# Altium schematic sheet DC075B_ANALOG_INPUTS.SchDoc: ANALOG INPUTS
size 558 x 431 mm; DrawnBy: Praveen Aroul; DocumentNumber: 5; SheetNumber: 5; SheetTotal: 13; PageSetup: Record=PageOptions|CenterHorizontal=True|CenterVertical=True|PrintScale=1.00|XCorrection=1.00|YCorrection=1.00|PrintKind=0|BorderSize=5000000|LeftOffset=0|BottomOffset=0|Orientation=2|PaperLength=1000|PaperWidth=1000|Scale=100|PaperSource=15|PrintQuality=600|MediaType=1|DitherType=10|PaperKind=Letter|PrintScaleMode=1
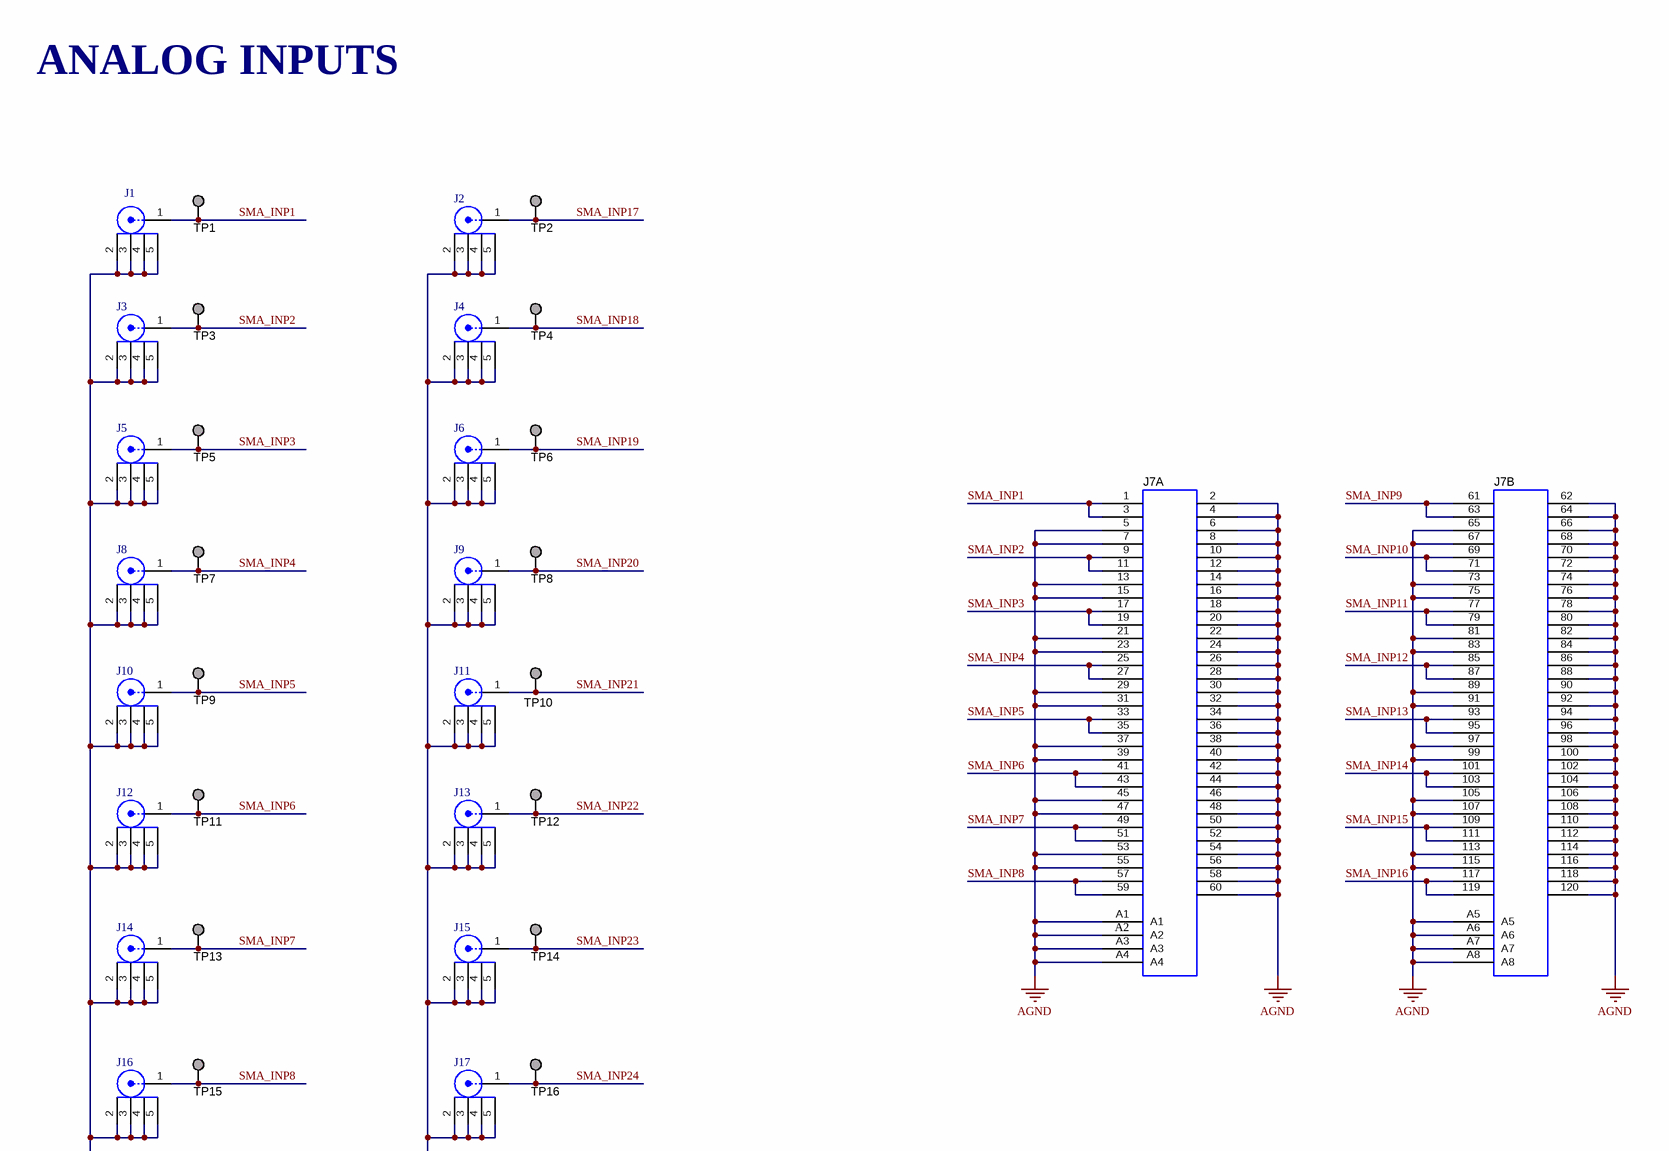
[diagram p0: DC075B_ANALOG_INPUTS.SchDoc, top left]
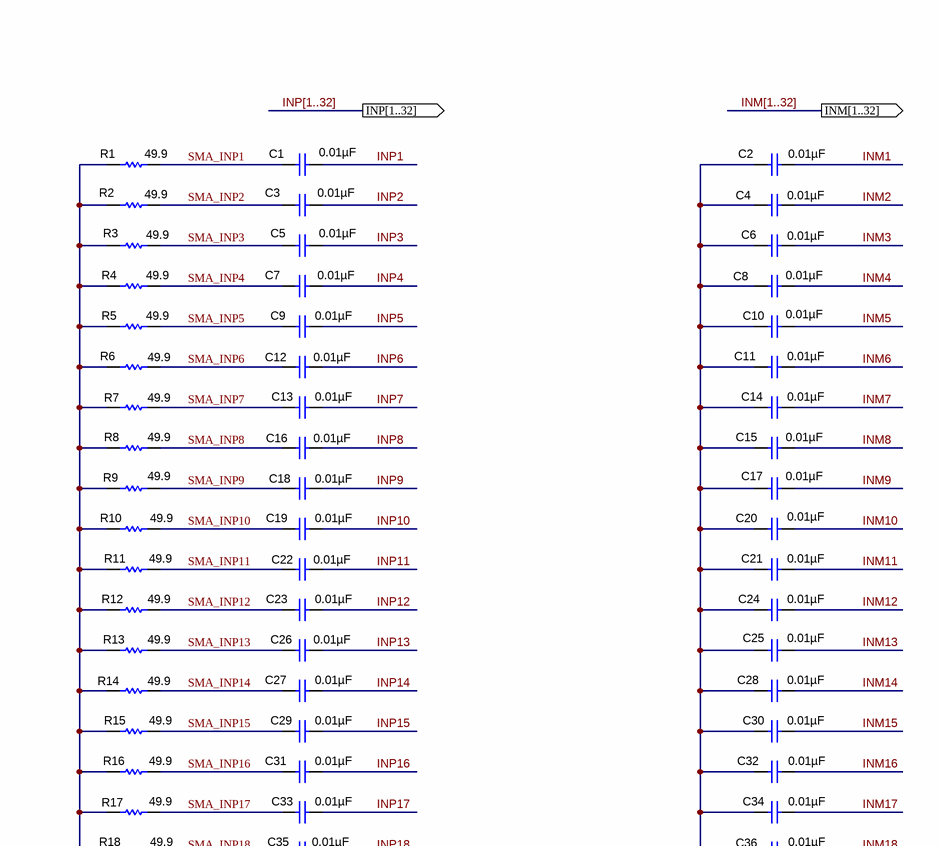
[diagram p1: DC075B_ANALOG_INPUTS.SchDoc, top right]
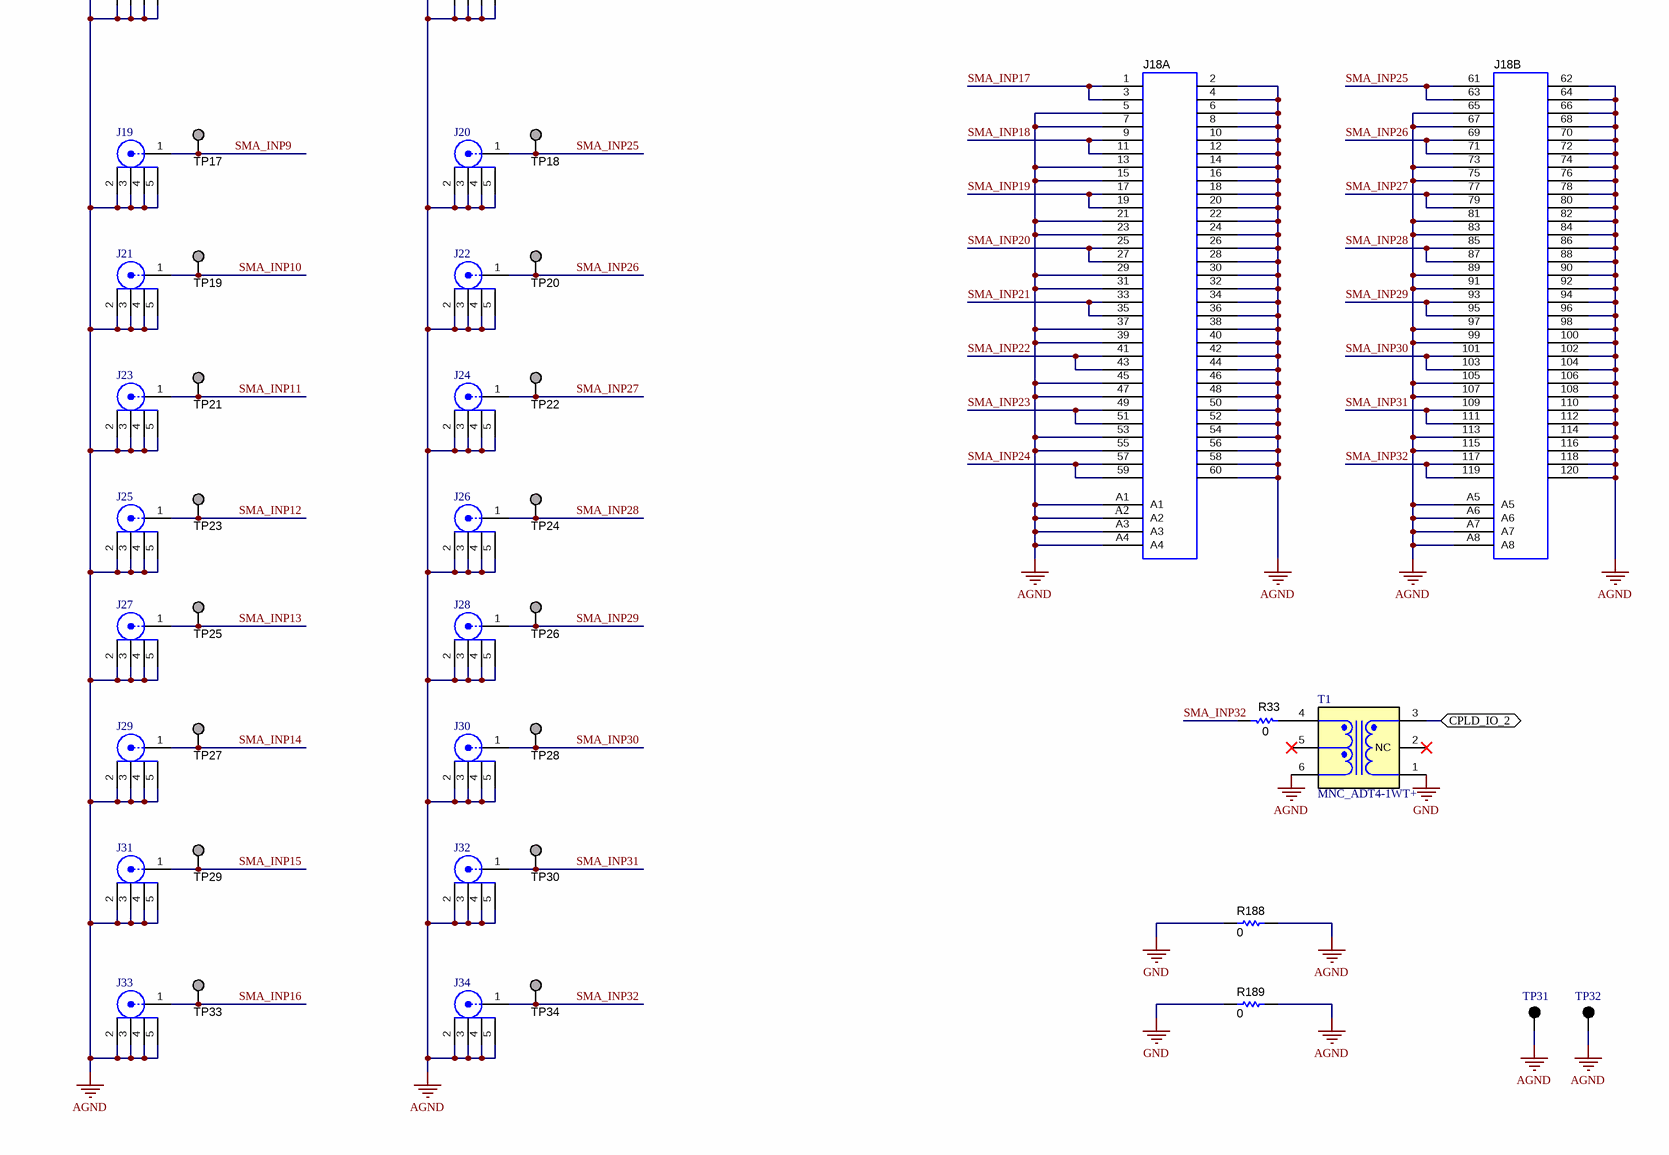
[diagram p2: DC075B_ANALOG_INPUTS.SchDoc, bottom left]
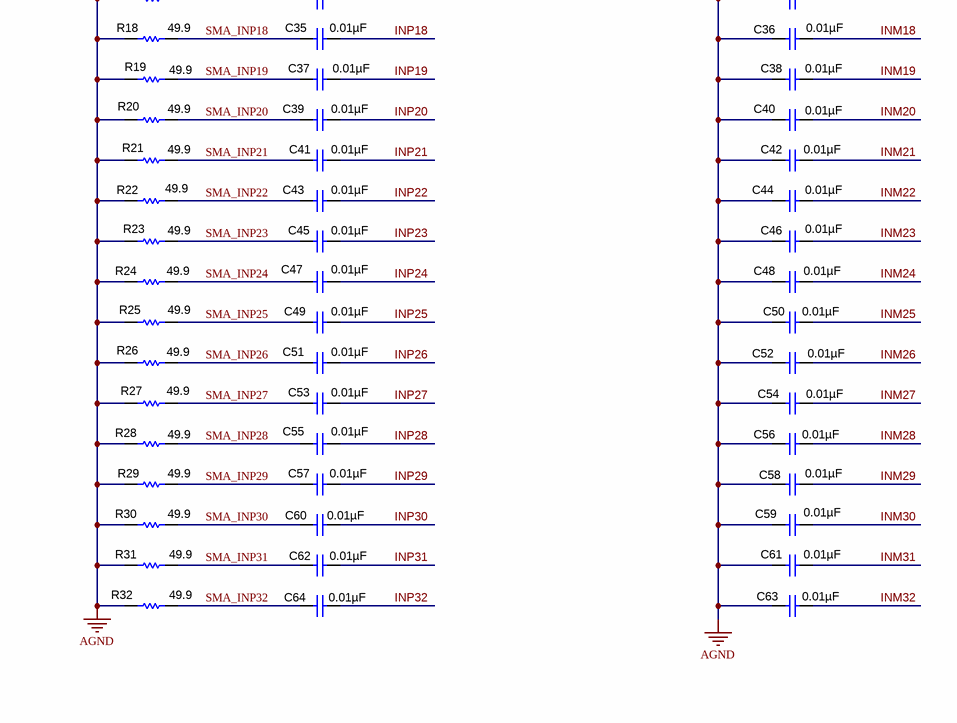
[diagram p3: DC075B_ANALOG_INPUTS.SchDoc, bottom right]

## Parts
C1  ValueDisplayed: 0.01µF  [0402]  (hidden comment: 04023C103JAT2A)
C2  ValueDisplayed: 0.01µF  [0402]  (hidden comment: 04023C103JAT2A)
C3  ValueDisplayed: 0.01µF  [0402]  (hidden comment: 04023C103JAT2A)
C4  ValueDisplayed: 0.01µF  [0402]  (hidden comment: 04023C103JAT2A)
C5  ValueDisplayed: 0.01µF  [0402]  (hidden comment: 04023C103JAT2A)
C6  ValueDisplayed: 0.01µF  [0402]  (hidden comment: 04023C103JAT2A)
C7  ValueDisplayed: 0.01µF  [0402]  (hidden comment: 04023C103JAT2A)
C8  ValueDisplayed: 0.01µF  [0402]  (hidden comment: 04023C103JAT2A)
C9  ValueDisplayed: 0.01µF  [0402]  (hidden comment: 04023C103JAT2A)
C10  ValueDisplayed: 0.01µF  [0402]  (hidden comment: 04023C103JAT2A)
C11  ValueDisplayed: 0.01µF  [0402]  (hidden comment: 04023C103JAT2A)
C12  ValueDisplayed: 0.01µF  [0402]  (hidden comment: 04023C103JAT2A)
C13  ValueDisplayed: 0.01µF  [0402]  (hidden comment: 04023C103JAT2A)
C14  ValueDisplayed: 0.01µF  [0402]  (hidden comment: 04023C103JAT2A)
C15  ValueDisplayed: 0.01µF  [0402]  (hidden comment: 04023C103JAT2A)
C16  ValueDisplayed: 0.01µF  [0402]  (hidden comment: 04023C103JAT2A)
C17  ValueDisplayed: 0.01µF  [0402]  (hidden comment: 04023C103JAT2A)
C18  ValueDisplayed: 0.01µF  [0402]  (hidden comment: 04023C103JAT2A)
C19  ValueDisplayed: 0.01µF  [0402]  (hidden comment: 04023C103JAT2A)
C20  ValueDisplayed: 0.01µF  [0402]  (hidden comment: 04023C103JAT2A)
C21  ValueDisplayed: 0.01µF  [0402]  (hidden comment: 04023C103JAT2A)
C22  ValueDisplayed: 0.01µF  [0402]  (hidden comment: 04023C103JAT2A)
C23  ValueDisplayed: 0.01µF  [0402]  (hidden comment: 04023C103JAT2A)
C24  ValueDisplayed: 0.01µF  [0402]  (hidden comment: 04023C103JAT2A)
C25  ValueDisplayed: 0.01µF  [0402]  (hidden comment: 04023C103JAT2A)
C26  ValueDisplayed: 0.01µF  [0402]  (hidden comment: 04023C103JAT2A)
C27  ValueDisplayed: 0.01µF  [0402]  (hidden comment: 04023C103JAT2A)
C28  ValueDisplayed: 0.01µF  [0402]  (hidden comment: 04023C103JAT2A)
C29  ValueDisplayed: 0.01µF  [0402]  (hidden comment: 04023C103JAT2A)
C30  ValueDisplayed: 0.01µF  [0402]  (hidden comment: 04023C103JAT2A)
C31  ValueDisplayed: 0.01µF  [0402]  (hidden comment: 04023C103JAT2A)
C32  ValueDisplayed: 0.01µF  [0402]  (hidden comment: 04023C103JAT2A)
C33  ValueDisplayed: 0.01µF  [0402]  (hidden comment: 04023C103JAT2A)
C34  ValueDisplayed: 0.01µF  [0402]  (hidden comment: 04023C103JAT2A)
C35  ValueDisplayed: 0.01µF  [0402]  (hidden comment: 04023C103JAT2A)
C36  ValueDisplayed: 0.01µF  [0402]  (hidden comment: 04023C103JAT2A)
C37  ValueDisplayed: 0.01µF  [0402]  (hidden comment: 04023C103JAT2A)
C38  ValueDisplayed: 0.01µF  [0402]  (hidden comment: 04023C103JAT2A)
C39  ValueDisplayed: 0.01µF  [0402]  (hidden comment: 04023C103JAT2A)
C40  ValueDisplayed: 0.01µF  [0402]  (hidden comment: 04023C103JAT2A)
C41  ValueDisplayed: 0.01µF  [0402]  (hidden comment: 04023C103JAT2A)
C42  ValueDisplayed: 0.01µF  [0402]  (hidden comment: 04023C103JAT2A)
C43  ValueDisplayed: 0.01µF  [0402]  (hidden comment: 04023C103JAT2A)
C44  ValueDisplayed: 0.01µF  [0402]  (hidden comment: 04023C103JAT2A)
C45  ValueDisplayed: 0.01µF  [0402]  (hidden comment: 04023C103JAT2A)
C46  ValueDisplayed: 0.01µF  [0402]  (hidden comment: 04023C103JAT2A)
C47  ValueDisplayed: 0.01µF  [0402]  (hidden comment: 04023C103JAT2A)
C48  ValueDisplayed: 0.01µF  [0402]  (hidden comment: 04023C103JAT2A)
C49  ValueDisplayed: 0.01µF  [0402]  (hidden comment: 04023C103JAT2A)
C50  ValueDisplayed: 0.01µF  [0402]  (hidden comment: 04023C103JAT2A)
C51  ValueDisplayed: 0.01µF  [0402]  (hidden comment: 04023C103JAT2A)
C52  ValueDisplayed: 0.01µF  [0402]  (hidden comment: 04023C103JAT2A)
C53  ValueDisplayed: 0.01µF  [0402]  (hidden comment: 04023C103JAT2A)
C54  ValueDisplayed: 0.01µF  [0402]  (hidden comment: 04023C103JAT2A)
C55  ValueDisplayed: 0.01µF  [0402]  (hidden comment: 04023C103JAT2A)
C56  ValueDisplayed: 0.01µF  [0402]  (hidden comment: 04023C103JAT2A)
C57  ValueDisplayed: 0.01µF  [0402]  (hidden comment: 04023C103JAT2A)
C58  ValueDisplayed: 0.01µF  [0402]  (hidden comment: 04023C103JAT2A)
C59  ValueDisplayed: 0.01µF  [0402]  (hidden comment: 04023C103JAT2A)
C60  ValueDisplayed: 0.01µF  [0402]  (hidden comment: 04023C103JAT2A)
C61  ValueDisplayed: 0.01µF  [0402]  (hidden comment: 04023C103JAT2A)
C62  ValueDisplayed: 0.01µF  [0402]  (hidden comment: 04023C103JAT2A)
C63  ValueDisplayed: 0.01µF  [0402]  (hidden comment: 04023C103JAT2A)
C64  ValueDisplayed: 0.01µF  [0402]  (hidden comment: 04023C103JAT2A)
J1  SMA_Contact1_GND2345  [Johnson_142-0701-801]  (value not drawn)
J2  5-1814832-1  [TE_5-1814832-1]  (value not drawn)
J3  5-1814832-1  [TE_5-1814832-1]  (value not drawn)
J4  SMA_Contact1_GND2345  [Johnson_142-0701-801]  (value not drawn)
J5  5-1814832-1  [TE_5-1814832-1]  (value not drawn)
J6  5-1814832-1  [TE_5-1814832-1]  (value not drawn)
J7  SAMTEC_QTH-060-01-L-D-A  [SAMTEC_QTH-060-01-L-D-A]  (value not drawn)  (parts A,B of 2)
J8  SMA_Contact1_GND2345  [Johnson_142-0701-801]  (value not drawn)
J9  5-1814832-1  [TE_5-1814832-1]  (value not drawn)
J10  5-1814832-1  [TE_5-1814832-1]  (value not drawn)
J11  SMA_Contact1_GND2345  [Johnson_142-0701-801]  (value not drawn)
J12  5-1814832-1  [TE_5-1814832-1]  (value not drawn)
J13  5-1814832-1  [TE_5-1814832-1]  (value not drawn)
J14  SMA_Contact1_GND2345  [Johnson_142-0701-801]  (value not drawn)
J15  5-1814832-1  [TE_5-1814832-1]  (value not drawn)
J16  5-1814832-1  [TE_5-1814832-1]  (value not drawn)
J17  SMA_Contact1_GND2345  [Johnson_142-0701-801]  (value not drawn)
J18  SAMTEC_QTH-060-01-L-D-A  [SAMTEC_QTH-060-01-L-D-A]  (value not drawn)  (parts A,B of 2)
J19  5-1814832-1  [TE_5-1814832-1]  (value not drawn)
J20  5-1814832-1  [TE_5-1814832-1]  (value not drawn)
J21  SMA_Contact1_GND2345  [Johnson_142-0701-801]  (value not drawn)
J22  5-1814832-1  [TE_5-1814832-1]  (value not drawn)
J23  5-1814832-1  [TE_5-1814832-1]  (value not drawn)
J24  SMA_Contact1_GND2345  [Johnson_142-0701-801]  (value not drawn)
J25  5-1814832-1  [TE_5-1814832-1]  (value not drawn)
J26  5-1814832-1  [TE_5-1814832-1]  (value not drawn)
J27  SMA_Contact1_GND2345  [Johnson_142-0701-801]  (value not drawn)
J28  5-1814832-1  [TE_5-1814832-1]  (value not drawn)
J29  5-1814832-1  [TE_5-1814832-1]  (value not drawn)
J30  SMA_Contact1_GND2345  [Johnson_142-0701-801]  (value not drawn)
J31  5-1814832-1  [TE_5-1814832-1]  (value not drawn)
J32  5-1814832-1  [TE_5-1814832-1]  (value not drawn)
J33  5-1814832-1  [TE_5-1814832-1]  (value not drawn)
J34  5-1814832-1  [TE_5-1814832-1]  (value not drawn)
R1  value 49.9  [0402]  (hidden comment: Resistor)
R2  value 49.9  [0402]  (hidden comment: Resistor)
R3  value 49.9  [0402]  (hidden comment: Resistor)
R4  value 49.9  [0402]  (hidden comment: Resistor)
R5  value 49.9  [0402]  (hidden comment: Resistor)
R6  value 49.9  [0402]  (hidden comment: Resistor)
R7  value 49.9  [0402]  (hidden comment: Resistor)
R8  value 49.9  [0402]  (hidden comment: Resistor)
R9  value 49.9  [0402]  (hidden comment: Resistor)
R10  value 49.9  [0402]  (hidden comment: Resistor)
R11  value 49.9  [0402]  (hidden comment: Resistor)
R12  value 49.9  [0402]  (hidden comment: Resistor)
R13  value 49.9  [0402]  (hidden comment: Resistor)
R14  value 49.9  [0402]  (hidden comment: Resistor)
R15  value 49.9  [0402]  (hidden comment: Resistor)
R16  value 49.9  [0402]  (hidden comment: Resistor)
R17  value 49.9  [0402]  (hidden comment: Resistor)
R18  value 49.9  [0402]  (hidden comment: Resistor)
R19  value 49.9  [0402]  (hidden comment: Resistor)
R20  value 49.9  [0402]  (hidden comment: Resistor)
R21  value 49.9  [0402]  (hidden comment: Resistor)
R22  value 49.9  [0402]  (hidden comment: Resistor)
R23  value 49.9  [0402]  (hidden comment: Resistor)
R24  value 49.9  [0402]  (hidden comment: Resistor)
R25  value 49.9  [0402]  (hidden comment: Resistor)
R26  value 49.9  [0402]  (hidden comment: Resistor)
R27  value 49.9  [0402]  (hidden comment: Resistor)
R28  value 49.9  [0402]  (hidden comment: Resistor)
R29  value 49.9  [0402]  (hidden comment: Resistor)
R30  value 49.9  [0402]  (hidden comment: Resistor)
R31  value 49.9  [0402]  (hidden comment: Resistor)
R32  value 49.9  [0402]  (hidden comment: Resistor)
R33  value 0  [0402]  (hidden comment: Resistor)
R188  ValueDisplayed: 0  [0805_HV]  (hidden comment: Resistor)
R189  ValueDisplayed: 0  [0805_HV]  (hidden comment: Resistor)
T1  MNC_ADT4-1WT+  [MNC_CD542]
TP1  Testpoint_Gray  [Keystone_5019]  (value not drawn)
TP2  Testpoint_Gray  [Keystone_5019]  (value not drawn)
TP3  Testpoint_Gray  [Keystone_5019]  (value not drawn)
TP4  Testpoint_Gray  [Keystone_5019]  (value not drawn)
TP5  Testpoint_Gray  [Keystone_5019]  (value not drawn)
TP6  Testpoint_Gray  [Keystone_5019]  (value not drawn)
TP7  Testpoint_Gray  [Keystone_5019]  (value not drawn)
TP8  Testpoint_Gray  [Keystone_5019]  (value not drawn)
TP9  Testpoint_Gray  [Keystone_5019]  (value not drawn)
TP10  Testpoint_Gray  [Keystone_5019]  (value not drawn)
TP11  Testpoint_Gray  [Keystone_5019]  (value not drawn)
TP12  Testpoint_Gray  [Keystone_5019]  (value not drawn)
TP13  Testpoint_Gray  [Keystone_5019]  (value not drawn)
TP14  Testpoint_Gray  [Keystone_5019]  (value not drawn)
TP15  Testpoint_Gray  [Keystone_5019]  (value not drawn)
TP16  Testpoint_Gray  [Keystone_5019]  (value not drawn)
TP17  Testpoint_Gray  [Keystone_5019]  (value not drawn)
TP18  Testpoint_Gray  [Keystone_5019]  (value not drawn)
TP19  Testpoint_Gray  [Keystone_5019]  (value not drawn)
TP20  Testpoint_Gray  [Keystone_5019]  (value not drawn)
TP21  Testpoint_Gray  [Keystone_5019]  (value not drawn)
TP22  Testpoint_Gray  [Keystone_5019]  (value not drawn)
TP23  Testpoint_Gray  [Keystone_5019]  (value not drawn)
TP24  Testpoint_Gray  [Keystone_5019]  (value not drawn)
TP25  Testpoint_Gray  [Keystone_5019]  (value not drawn)
TP26  Testpoint_Gray  [Keystone_5019]  (value not drawn)
TP27  Testpoint_Gray  [Keystone_5019]  (value not drawn)
TP28  Testpoint_Gray  [Keystone_5019]  (value not drawn)
TP29  Testpoint_Gray  [Keystone_5019]  (value not drawn)
TP30  Testpoint_Gray  [Keystone_5019]  (value not drawn)
TP31  5001  [Keystone5001]  (value not drawn)
TP32  5001  [Keystone5001]  (value not drawn)
TP33  Testpoint_Gray  [Keystone_5019]  (value not drawn)
TP34  Testpoint_Gray  [Keystone_5019]  (value not drawn)

## Ports
CPLD_IO_2, INM[1..32] (out), INP[1..32] (out)

## Nets
AGND: C2.2 C4.2 C6.2 C8.2 C10.2 C11.2 C14.2 C15.2 C17.2 C20.2 C21.2 C24.2 C25.2 C28.2 C30.2 C32.2 C34.2 C36.2 C38.2 C40.2 C42.2 C44.2 C46.2 C48.2 C50.2 C52.2 C54.2 C56.2 C58.2 C59.2 C61.2 C63.2 J1.2 J1.3 J1.4 J1.5 J2.2 J2.3 J2.4 J2.5 J3.2 J3.3 J3.4 J3.5 J4.2 J4.3 J4.4 J4.5 J5.2 J5.3 J5.4 J5.5 J6.2 J6.3 J6.4 J6.5 J7.2 J7.4 J7.5 J7.6 J7.7 J7.8 J7.10 J7.12 J7.13 J7.14 J7.15 J7.16 J7.18 J7.20 J7.21 J7.22 J7.23 J7.24 J7.26 J7.28 J7.29 J7.30 J7.31 J7.32 J7.34 J7.36 J7.37 J7.38 J7.39 J7.40 J7.42 J7.44 J7.45 J7.46 J7.47 J7.48 J7.50 J7.52 J7.53 J7.54 J7.55 J7.56 J7.58 J7.60 J7.62 J7.64 J7.65 J7.66 J7.67 J7.68 J7.70 J7.72 J7.73 J7.74 J7.75 J7.76 J7.78 J7.80 J7.81 J7.82 J7.83 J7.84 J7.86 J7.88 J7.89 J7.90 J7.91 J7.92 J7.94 J7.96 J7.97 J7.98 J7.99 J7.100 J7.102 J7.104 J7.105 J7.106 J7.107 J7.108 J7.110 J7.112 J7.113 J7.114 J7.115 J7.116 J7.118 J7.120 J7.A1 J7.A2 J7.A3 J7.A4 J7.A5 J7.A6 J7.A7 J7.A8 J8.2 J8.3 J8.4 J8.5 J9.2 J9.3 J9.4 J9.5 J10.2 J10.3 J10.4 J10.5 J11.2 J11.3 J11.4 J11.5 J12.2 J12.3 J12.4 J12.5 J13.2 J13.3 J13.4 J13.5 J14.2 J14.3 J14.4 J14.5 J15.2 J15.3 J15.4 J15.5 J16.2 J16.3 J16.4 J16.5 J17.2 J17.3 J17.4 J17.5 J18.2 J18.4 J18.5 J18.6 J18.7 J18.8 J18.10 J18.12 J18.13 J18.14 J18.15 J18.16 J18.18 J18.20 J18.21 J18.22 J18.23 J18.24 J18.26 J18.28 J18.29 J18.30 J18.31 J18.32 J18.34 J18.36 J18.37 J18.38 J18.39 J18.40 J18.42 J18.44 J18.45 J18.46 J18.47 J18.48 J18.50 J18.52 J18.53 J18.54 J18.55 J18.56 J18.58 J18.60 J18.62 J18.64 J18.65 J18.66 J18.67 J18.68 J18.70 J18.72 J18.73 J18.74 J18.75 J18.76 J18.78 J18.80 J18.81 J18.82 J18.83 J18.84 J18.86 J18.88 J18.89 J18.90 J18.91 J18.92 J18.94 J18.96 J18.97 J18.98 J18.99 J18.100 J18.102 J18.104 J18.105 J18.106 J18.107 J18.108 J18.110 J18.112 J18.113 J18.114 J18.115 J18.116 J18.118 J18.120 J18.A1 J18.A2 J18.A3 J18.A4 J18.A5 J18.A6 J18.A7 J18.A8 J19.2 J19.3 J19.4 J19.5 J20.2 J20.3 J20.4 J20.5 J21.2 J21.3 J21.4 J21.5 J22.2 J22.3 J22.4 J22.5 J23.2 J23.3 J23.4 J23.5 J24.2 J24.3 J24.4 J24.5 J25.2 J25.3 J25.4 J25.5 J26.2 J26.3 J26.4 J26.5 J27.2 J27.3 J27.4 J27.5 J28.2 J28.3 J28.4 J28.5 J29.2 J29.3 J29.4 J29.5 J30.2 J30.3 J30.4 J30.5 J31.2 J31.3 J31.4 J31.5 J32.2 J32.3 J32.4 J32.5 J33.2 J33.3 J33.4 J33.5 J34.2 J34.3 J34.4 J34.5 R1.1 R2.1 R3.1 R4.1 R5.1 R6.1 R7.1 R8.1 R9.1 R10.1 R11.1 R12.1 R13.1 R14.1 R15.1 R16.1 R17.1 R18.1 R19.1 R20.1 R21.1 R22.1 R23.1 R24.1 R25.1 R26.1 R27.1 R28.1 R29.1 R30.1 R31.1 R32.1 R188.2 R189.2 T1.6 TP31.1 TP32.1
GND: R188.1 R189.1 T1.1
CPLD_IO_2: T1.3 ; port CPLD_IO_2
INM1: C2.1
INM2: C4.1
INM3: C6.1
INM4: C8.1
INM5: C10.1
INM6: C11.1
INM7: C14.1
INM8: C15.1
INM9: C17.1
INM10: C20.1
INM11: C21.1
INM12: C24.1
INM13: C25.1
INM14: C28.1
INM15: C30.1
INM16: C32.1
INM17: C34.1
INM18: C36.1
INM19: C38.1
INM20: C40.1
INM21: C42.1
INM22: C44.1
INM23: C46.1
INM24: C48.1
INM25: C50.1
INM26: C52.1
INM27: C54.1
INM28: C56.1
INM29: C58.1
INM30: C59.1
INM31: C61.1
INM32: C63.1
INP1: C1.1
INP2: C3.1
INP3: C5.1
INP4: C7.1
INP5: C9.1
INP6: C12.1
INP7: C13.1
INP8: C16.1
INP9: C18.1
INP10: C19.1
INP11: C22.1
INP12: C23.1
INP13: C26.1
INP14: C27.1
INP15: C29.1
INP16: C31.1
INP17: C33.1
INP18: C35.1
INP19: C37.1
INP20: C39.1
INP21: C41.1
INP22: C43.1
INP23: C45.1
INP24: C47.1
INP25: C49.1
INP26: C51.1
INP27: C53.1
INP28: C55.1
INP29: C57.1
INP30: C60.1
INP31: C62.1
INP32: C64.1
SMA_INP1: C1.2 J1.1 J7.1 J7.3 R1.2 TP1.1
SMA_INP2: C3.2 J3.1 J7.9 J7.11 R2.2 TP3.1
SMA_INP3: C5.2 J5.1 J7.17 J7.19 R3.2 TP5.1
SMA_INP4: C7.2 J7.25 J7.27 J8.1 R4.2 TP7.1
SMA_INP5: C9.2 J7.33 J7.35 J10.1 R5.2 TP9.1
SMA_INP6: C12.2 J7.41 J7.43 J12.1 R6.2 TP11.1
SMA_INP7: C13.2 J7.49 J7.51 J14.1 R7.2 TP13.1
SMA_INP8: C16.2 J7.57 J7.59 J16.1 R8.2 TP15.1
SMA_INP9: C18.2 J7.61 J7.63 J19.1 R9.2 TP17.1
SMA_INP10: C19.2 J7.69 J7.71 J21.1 R10.2 TP19.1
SMA_INP11: C22.2 J7.77 J7.79 J23.1 R11.2 TP21.1
SMA_INP12: C23.2 J7.85 J7.87 J25.1 R12.2 TP23.1
SMA_INP13: C26.2 J7.93 J7.95 J27.1 R13.2 TP25.1
SMA_INP14: C27.2 J7.101 J7.103 J29.1 R14.2 TP27.1
SMA_INP15: C29.2 J7.109 J7.111 J31.1 R15.2 TP29.1
SMA_INP16: C31.2 J7.117 J7.119 J33.1 R16.2 TP33.1
SMA_INP17: C33.2 J2.1 J18.1 J18.3 R17.2 TP2.1
SMA_INP18: C35.2 J4.1 J18.9 J18.11 R18.2 TP4.1
SMA_INP19: C37.2 J6.1 J18.17 J18.19 R19.2 TP6.1
SMA_INP20: C39.2 J9.1 J18.25 J18.27 R20.2 TP8.1
SMA_INP21: C41.2 J11.1 J18.33 J18.35 R21.2 TP10.1
SMA_INP22: C43.2 J13.1 J18.41 J18.43 R22.2 TP12.1
SMA_INP23: C45.2 J15.1 J18.49 J18.51 R23.2 TP14.1
SMA_INP24: C47.2 J17.1 J18.57 J18.59 R24.2 TP16.1
SMA_INP25: C49.2 J18.61 J18.63 J20.1 R25.2 TP18.1
SMA_INP26: C51.2 J18.69 J18.71 J22.1 R26.2 TP20.1
SMA_INP27: C53.2 J18.77 J18.79 J24.1 R27.2 TP22.1
SMA_INP28: C55.2 J18.85 J18.87 J26.1 R28.2 TP24.1
SMA_INP29: C57.2 J18.93 J18.95 J28.1 R29.2 TP26.1
SMA_INP30: C60.2 J18.101 J18.103 J30.1 R30.2 TP28.1
SMA_INP31: C62.2 J18.109 J18.111 J32.1 R31.2 TP30.1
SMA_INP32: C64.2 J18.117 J18.119 J34.1 R32.2 R33.2 TP34.1
NetR33_1: R33.1 T1.4

Not connected (* = marked no-connect by the designer): T1 2(NC)* 5*

## Buses and harness runs
bus INM[1..32] = port INM[1..32]
bus INP[1..32] = port INP[1..32]

## Notes on the sheet
- ANALOG INPUTS
- Drawn By:
- SVN Rev:
- Number:
- TID #:
- Orderable:
- Rev:
- Sheet Title:
- File:
- Project Title:
- Designed for:
- Assembly Variant:
- Mod. Date:
- Sheet:
- Size:
- of
- C
- http://www.ti.com
- Texas Instruments and/or its licensors do not warrant the accuracy or completeness of this specification or any information contained therein. Texas Instruments and/or its licensors do not warrant that this design will meet the specifications, will be suitable for your application or fit for any particular purpose, or will operate in an implementation. Texas Instruments and/or its licensors do not warrant that the design is production worthy. You should completely validate and test your design implementation to confirm the system functionality for your application.
- Engineer:
- Contact:
- © Texas Instruments

## Library data of the parts
C1-C64 = CMP-0085568-1: CAP, CERM, 0.01 µF, 25 V,+/- 5%, X7R, 0402; Manufacturer: AVX; Polarized: N; Value: 0.01uF; U/M: EA; Cap_F: 10nF; VDC_V: 25V; TaMin_C: -55°C; TaMax_C: 125°C; AEC Category: Q200; SizeArea_mm2: 0.5; SizeAreaWB_mm2: 3; SizeX_mm: 1; SizeZ_mm: 0.6; CompType: Capacitor; PartNumber: 04023C103JAT2A; PackageReference: 0402; RoHS: Y; Tolerance_%: 5%; Value2: 25V; MountType: SMT; Technology: Ceramic; TempCo: X7R; Cap_Case: 0402; ComponentLink1Description: Datasheet link; ComponentLink1URL: http://datasheets.avx.com/X7RDielectric.pdf; AEC Grade: N/A; AEC Qualified: N; SizeY_mm: 0.5
J1 J4 J8 J11 J14 J17 J21 J24 J27 J30 = CMP-0055828-1: Connector, End launch SMA, 50 ohm, SMT; PartNumber: 142-0701-801; Manufacturer: Cinch Connectivity; CNHeader: FALSE; CT: TRUE; Green_Lifecycle: Not Set; Green_REACh: Incomplete; PackageReference: End Launch SMA; CompType: SMA; RoHS: Y; MountType: SMT; ComponentLink1Description: Datasheet URL; ComponentLink1URL: http://emersonconnectivity.com/OA_MEDIA/specs/pi-142-0701-801.pdf; Publisher: Texas Instruments; LatestRevisionDate: 26/05/2017; Supplier 1: Digi-Key; Supplier Part Number 1: J502-ND; Supplier 2: Newark; Supplier Part Number 2: 90F2624; Supplier 3: Mouser; Supplier Part Number 3: 530-142-0701-801; Green_EU RoHS-2: Incomplete; Green_EU RoHS: Incomplete
J2 J3 J5 J6 J9 J10 J12 J13 J15 J16 J19 J20 J22 J23 J25 J26 J28 J29 J31-J34 = CMP-0054990-1: SMA Straight PCB Socket Die Cast, 50 Ohm, TH; Manufacturer: TE Connectivity; Green_Lifecycle: Active; Green_REACh: Passed; CNHeader: FALSE; CT: TRUE; PartNumber: 5-1814832-1; PackageReference: SMA Straight PCB Socket Die Cast, TH; CompType: SMA; RoHS: Y; MountType: TH; ComponentLink1Description: Datasheet URL; ComponentLink1URL: http://www.te.com/commerce/DocumentDelivery/DDEController?Action=srchrtrv&DocNm=1814832&DocType=Customer+Drawing&DocLang=English; Supplier 1: Digi-Key; Supplier Part Number 1: A97594-ND; Supplier 2: Newark; Supplier Part Number 2: 78M7270; Supplier 3: Mouser; Supplier Part Number 3: 571-5-1814832-1; Green_EU RoHS-2: Incomplete; Green_EU RoHS: Passed with Exemption; Publisher: Texas Instruments; LatestRevisionDate: 26/05/2017
J7 J18 = CMP-0056023-2: Socket, 0.5MM, 60x2, Gold, SMT; Manufacturer: Samtec; Green_Lifecycle: Not Set; Green_REACh: Incomplete; PartNumber: QTH-060-01-L-D-A; PackageReference: Socket, Female, 0.5MM, 60x2, SMT; CompType: Socket; RoHS: Y; MountType: SMT; ComponentLink1Description: Datasheet URL; ComponentLink1URL: http://www.samtec.com/documents/webfiles/cpdf/QTH-XXX-XX-X-D-XXX-MKT.pdf; Supplier 1: Digi-Key; Supplier Part Number 1: SAM8189-ND; Supplier 2: Newark; Supplier Part Number 2: 11P6110; Supplier 3: Farnell; Supplier Part Number 3: 1667909; Green_EU RoHS-2: Incomplete; Green_EU RoHS: Incomplete
R1-R32 = CMP-0026404-2: RES, 49.9, 1%, 0.063 W, AEC-Q200 Grade 0, 0402; Manufacturer: Vishay-Dale; PartNumber: CRCW040249R9FKED; Value_Code: 49R9; Power_W: 63mW; Value2: 0.063W; VDC_V: 50V; TempCo: 100 ppm/C; EIA_Code: E96; AEC Category: Q200; AEC Grade: 0; AEC Qualified: Y; SizeArea_mm2: 0.5; SizeX_mm: 1; SizeZ_mm: 0.6; ComponentLink1Description: Datasheet link; ComponentLink1URL: http://www.vishay.com/docs/20035/dcrcwe3.pdf; CompType: Resistor; MountType: SMT; PackageReference: 0402; RoHS: E; ValueDisplayed: 49.9; Res_ohm: 49.9; Tolerance_%: 1%; Value1: 1%; Technology: Thick Film; Supplier 1: Digi-Key; Supplier Part Number 1: 541-49.9LCT-ND; Supplier 2: Newark; Supplier Part Number 2: 52K7114; Supplier 3: Mouser; Supplier Part Number 3: 71-CRCW0402-49.9-E3; SizeY_mm: 0.5
R33 = CMP-0026822-3: RES, 0, 5%, 0.063 W, AEC-Q200 Grade 0, 0402; Manufacturer: Vishay-Dale; PartNumber: CRCW04020000Z0ED; Value_Code: 0000; Power_W: 63mW; Value2: 0.063W; VDC_V: 50V; TempCo: 200 ppm/C; EIA_Code: E24; AEC Category: Q200; AEC Qualified: Y; SizeArea_mm2: 0.5; SizeX_mm: 1; SizeZ_mm: 0.6; ComponentLink1Description: Datasheet link; ComponentLink1URL: http://www.vishay.com/docs/20035/dcrcwe3.pdf; CompType: Resistor; MountType: SMT; PackageReference: 0402; RoHS: E; ValueDisplayed: 0; Res_ohm: 0; Tolerance_%: 5%; Value1: 5%; Technology: Thick Film; Supplier 1: Digi-Key; Supplier Part Number 1: 541-0.0JCT-ND; Supplier 2: Newark; Supplier Part Number 2: 52K6543; Supplier 3: Mouser; Supplier Part Number 3: 71-CRCW0402-0-E3; AEC Grade: 0; SizeY_mm: 0.5
R188 R189 = CMP-0020802-2: RES, 0, 5%, 0.125 W, 0805; PartNumber: MCR10EZPJ000; Manufacturer: Rohm; Value: 0; Value_Code: 0000; Power_W: 125mW; Value2: 0.125W; VDC_V: 150V; TempCo: 400 ppm/C; SizeArea_mm2: 2.5; SizeX_mm: 2; SizeY_mm: 1.25; SizeZ_mm: 1.45; EIA_Code: E24; U/M: EA; AEC Category: Q200; CompType: Resistor; PackageReference: 0805; RoHS: Y; Res_ohm: 0; Tolerance_%: 5%; Value1: 5%; MountType: SMT; Technology: Thick Film; Published: 2008-06-26; Publisher: Texas Instruments; LatestRevisionDate: 2017-03-09; ComponentLink1Description: Datasheet link; ComponentLink1URL: http://www.rohm.com/products/databook/r/pdf/mcr10.pdf; Supplier 1: Digi-Key; Supplier Part Number 1: RHM0.0ARCT-ND; AEC Qualified: ?
T1 = CMP-0030461-2: RF Transformer, 50 ohm, 2 to 775 MHz, SMT; Manufacturer: Minicircuits; Green_Lifecycle: Not Set; Green_REACh: Incomplete; PartNumber: ADT4-1WT+; CompType: Transformer; PackageReference: CD542; MountType: SMT; RoHS: Y; ComponentLink1Description: Datasheet URL; ComponentLink1URL: http://www.minicircuits.com/pdfs/ADT4-1WT.pdf; Publisher: Texas Instruments; LatestRevisionDate: 2017-05-09; Green_EU RoHS-2: Incomplete; Green_EU RoHS: Incomplete
TP1-TP30 TP33 TP34 = CMP-0055162-1: Test Point, Miniature, SMT; PartNumber: 5019; Manufacturer: Keystone; CNHeader: FALSE; CT: TRUE; Green_Lifecycle: Active; Green_REACh: Passed; CompType: Test Point; PackageReference: Test Point, Miniature, SMT; RoHS: Y; MountType: SMT; ComponentLink1Description: Datasheet URL; ComponentLink1URL: http://www.keyelco.com/product-pdf.cfm?p=1357; Publisher: Texas Instruments; LatestRevisionDate: 26/05/2017; Supplier 1: Digi-Key; Supplier Part Number 1: 36-5019TR-ND; Supplier 2: Mouser; Supplier Part Number 2: 534-5019; Green_EU RoHS-2: Incomplete; Green_EU RoHS: Passed
TP31 TP32 = CMP-0055138-1: Test Point, Miniature, Black, TH; Manufacturer: Keystone; CNHeader: FALSE; ContactFinish: Silver; CT: TRUE; Green_Lifecycle: Active; Green_REACh: Passed; PartNumber: 5001; PackageReference: Black Miniature Testpoint; CompType: Test Point; RoHS: Y; MountType: TH; ComponentLink1Description: Datasheet URL; ComponentLink1URL: http://www.keyelco.com/userAssets/file/M60-2p60.pdf; Publisher: Texas Instruments; LatestRevisionDate: 26/05/2017; Supplier 1: Digi-Key; Supplier Part Number 1: 36-5001-ND; Supplier 2: Mouser; Supplier Part Number 2: 534-5001; Color: Black; Green_EU RoHS-2: Incomplete; Green_EU RoHS: Passed